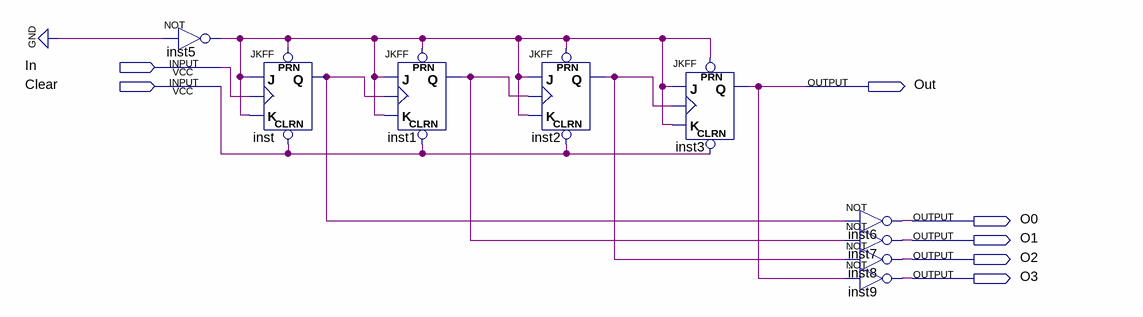
[diagram p0: schematic sheet]
// Quartus schematic Cont8jk.bdf as structural Verilog: 9 symbols, 7 pins
module Cont8jk (
  input  In,
  input  Clear,
  output Out,
  output O0,
  output O1,
  output O2,
  output O3
);

  wire inst1_q, inst2_q, inst5_out, inst_q;

  not inst5 (inst5_out, 1'b0);
  JKFF inst (.PRN(inst5_out), .CLRN(Clear), .K(inst5_out), .J(inst5_out), .CLK(In), .Q(inst_q));
  JKFF inst1 (.PRN(inst5_out), .CLRN(Clear), .K(inst5_out), .J(inst5_out), .CLK(inst_q), .Q(inst1_q));
  JKFF inst2 (.PRN(inst5_out), .CLRN(Clear), .K(inst5_out), .J(inst5_out), .CLK(inst1_q), .Q(inst2_q));
  JKFF inst3 (.PRN(inst5_out), .CLRN(Clear), .K(inst5_out), .J(inst5_out), .CLK(inst2_q), .Q(Out));
  not inst6 (O0, inst_q);
  not inst7 (O1, inst1_q);
  not inst8 (O2, inst2_q);
  not inst9 (O3, Out);
endmodule
